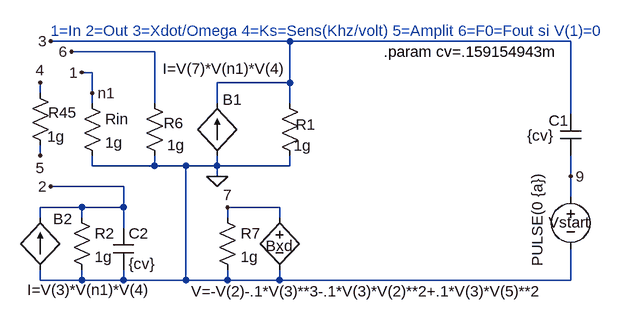
[diagram p0: schematic vcomin.asc]
vcomin.asc, the LTspice schematic file:
Version 4
SHEET 1 1184 680
WIRE -240 208 -240 192
WIRE -240 304 -240 288
WIRE -240 400 -240 384
WIRE -240 496 -240 480
WIRE -176 384 -240 384
WIRE -176 400 -176 384
WIRE -176 496 -240 496
WIRE -176 496 -176 480
WIRE -160 176 -176 176
WIRE -160 208 -160 176
WIRE -160 224 -160 208
WIRE -160 320 -160 304
WIRE -112 352 -224 352
WIRE -112 384 -176 384
WIRE -112 384 -112 352
WIRE -112 416 -112 384
WIRE -112 496 -176 496
WIRE -112 496 -112 480
WIRE -64 144 -192 144
WIRE -64 224 -64 144
WIRE -64 320 -160 320
WIRE -64 320 -64 304
WIRE -16 320 -64 320
WIRE -16 496 -112 496
WIRE -16 496 -16 320
WIRE 32 224 32 192
WIRE 32 320 -16 320
WIRE 32 320 32 304
WIRE 32 336 32 320
WIRE 48 400 48 384
WIRE 48 496 -16 496
WIRE 48 496 48 480
WIRE 128 384 48 384
WIRE 128 400 128 384
WIRE 128 496 48 496
WIRE 128 496 128 480
WIRE 144 128 -224 128
WIRE 144 192 32 192
WIRE 144 192 144 128
WIRE 144 224 144 192
WIRE 144 320 32 320
WIRE 144 320 144 304
WIRE 576 128 144 128
WIRE 576 240 576 128
WIRE 576 336 576 304
WIRE 576 368 576 336
WIRE 576 496 128 496
WIRE 576 496 576 448
FLAG 32 336 0
FLAG -176 176 1
FLAG -224 128 3
FLAG 48 384 7
FLAG -224 352 2
FLAG 576 336 9
FLAG -240 192 4
FLAG -240 304 5
FLAG -192 144 6
FLAG -160 208 n1
SYMBOL res -176 208 R0
SYMATTR InstName Rin
SYMATTR Value 1g
SYMBOL bi 32 304 R180
WINDOW 0 -38 86 Left 0
WINDOW 3 -106 134 Left 0
SYMATTR InstName B1
SYMATTR Value I=V(7)*V(n1)*V(4)
SYMBOL res 128 208 R0
WINDOW 0 25 48 Left 0
WINDOW 3 22 81 Left 0
SYMATTR InstName R1
SYMATTR Value 1g
SYMBOL bi -240 480 R180
WINDOW 0 -49 78 Left 0
WINDOW 3 -170 -31 Left 0
SYMATTR InstName B2
SYMATTR Value I=V(3)*V(n1)*V(4)
SYMBOL res -192 384 R0
SYMATTR InstName R2
SYMATTR Value 1g
SYMBOL cap -128 416 R0
WINDOW 3 24 55 Left 0
SYMATTR Value {cv}
SYMATTR InstName C2
SYMBOL bv 128 384 R0
WINDOW 0 -21 59 Left 0
WINDOW 3 -136 129 Left 0
SYMATTR InstName Bxd
SYMATTR Value V=-V(2)-.1*V(3)**3-.1*V(3)*V(2)**2+.1*V(3)*V(5)**2
SYMBOL res 32 384 R0
SYMATTR InstName R7
SYMATTR Value 1g
SYMBOL voltage 576 352 R0
WINDOW 0 -34 55 Left 0
WINDOW 3 -51 -22 VRight 0
WINDOW 123 0 0 Left 0
WINDOW 39 0 0 Left 0
SYMATTR InstName Vstart
SYMATTR Value PULSE(0 {a})
SYMBOL cap 560 240 R0
WINDOW 0 -18 10 Left 0
WINDOW 3 -10 33 Right 0
SYMATTR InstName C1
SYMATTR Value {cv}
SYMBOL res -256 192 R0
WINDOW 0 28 46 Left 0
WINDOW 3 27 83 Left 0
SYMATTR InstName R45
SYMATTR Value 1g
SYMBOL res -80 208 R0
WINDOW 0 30 46 Left 0
WINDOW 3 35 80 Left 0
SYMATTR InstName R6
SYMATTR Value 1g
TEXT -224 112 Left 0 ;1=In 2=Out 3=Xdot/Omega 4=Ks=Sens(Khz/volt) 5=Amplit 6=F0=Fout si V(1)=0
TEXT 288 144 Left 0 !.param cv=.159154943m

The netlist it stands for:
* vcomin.asc
Rin n1 0 1g
B1 0 3 I=V(7)*V(n1)*V(4)
R1 3 0 1g
B2 0 2 I=V(3)*V(n1)*V(4)
R2 2 0 1g
C2 2 0 {cv}
Bxd 7 0 V=-V(2)-.1*V(3)**3-.1*V(3)*V(2)**2+.1*V(3)*V(5)**2
R7 7 0 1g
Vstart 9 0 PULSE(0 {a})
C1 3 9 {cv}
R45 4 5 1g
R6 6 0 1g
* 1=In 2=Out 3=Xdot/Omega 4=Ks=Sens(Khz/volt) 5=Amplit 6=F0=Fout si V(1)=0
.param cv=.159154943m
.backanno
.end